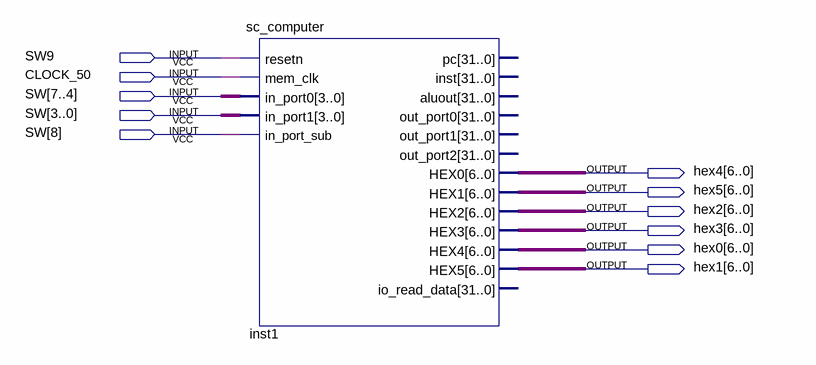
[diagram p0: schematic sheet]
// Quartus schematic sc_computer_sim.bdf as structural Verilog: 1 symbols, 11 pins
module sc_computer_sim (
  input  SW9,
  input  CLOCK_50,
  input  [8:0] SW,
  output [6:0] hex4,
  output [6:0] hex5,
  output [6:0] hex2,
  output [6:0] hex3,
  output [6:0] hex0,
  output [6:0] hex1
);

  sc_computer inst1 (
    .resetn(SW9), .mem_clk(CLOCK_50), .in_port0(SW[7:4]), .in_port1(SW[3:0]), .in_port_sub(SW[8]),
    .HEX0(hex4), .HEX1(hex5), .HEX2(hex2), .HEX3(hex3), .HEX4(hex0), .HEX5(hex1));  // open: pc, inst, aluout, out_port0, out_port1, out_port2, io_read_data
endmodule
